# EasyEDA Pro project ProPrj_HEMY 2.0_2025-04-23.epro, board HEMY Redux v2.6.5M
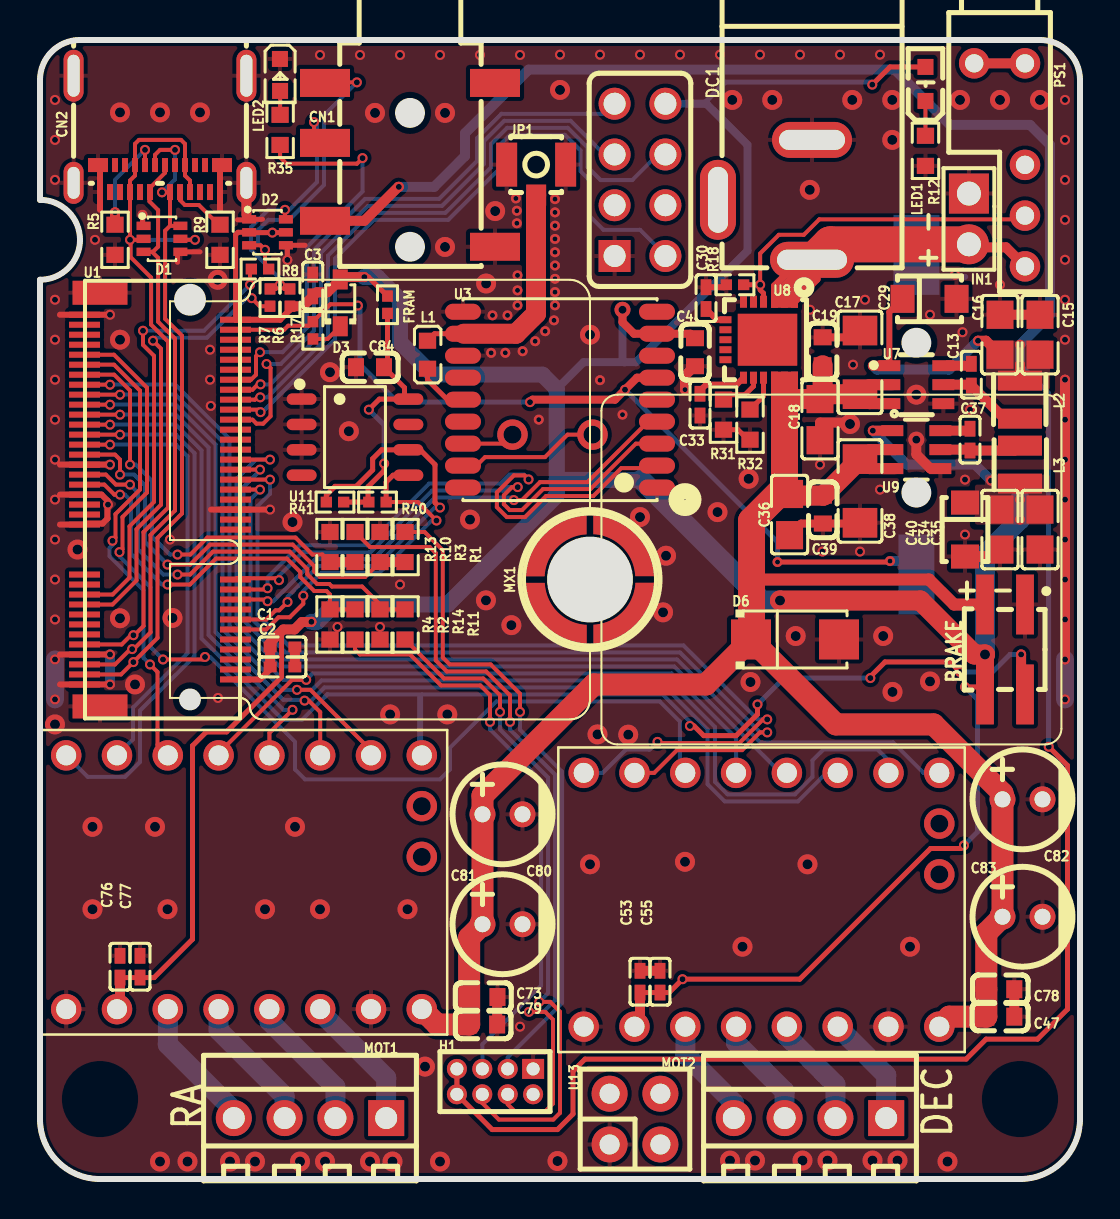
[diagram p8: board, top side]
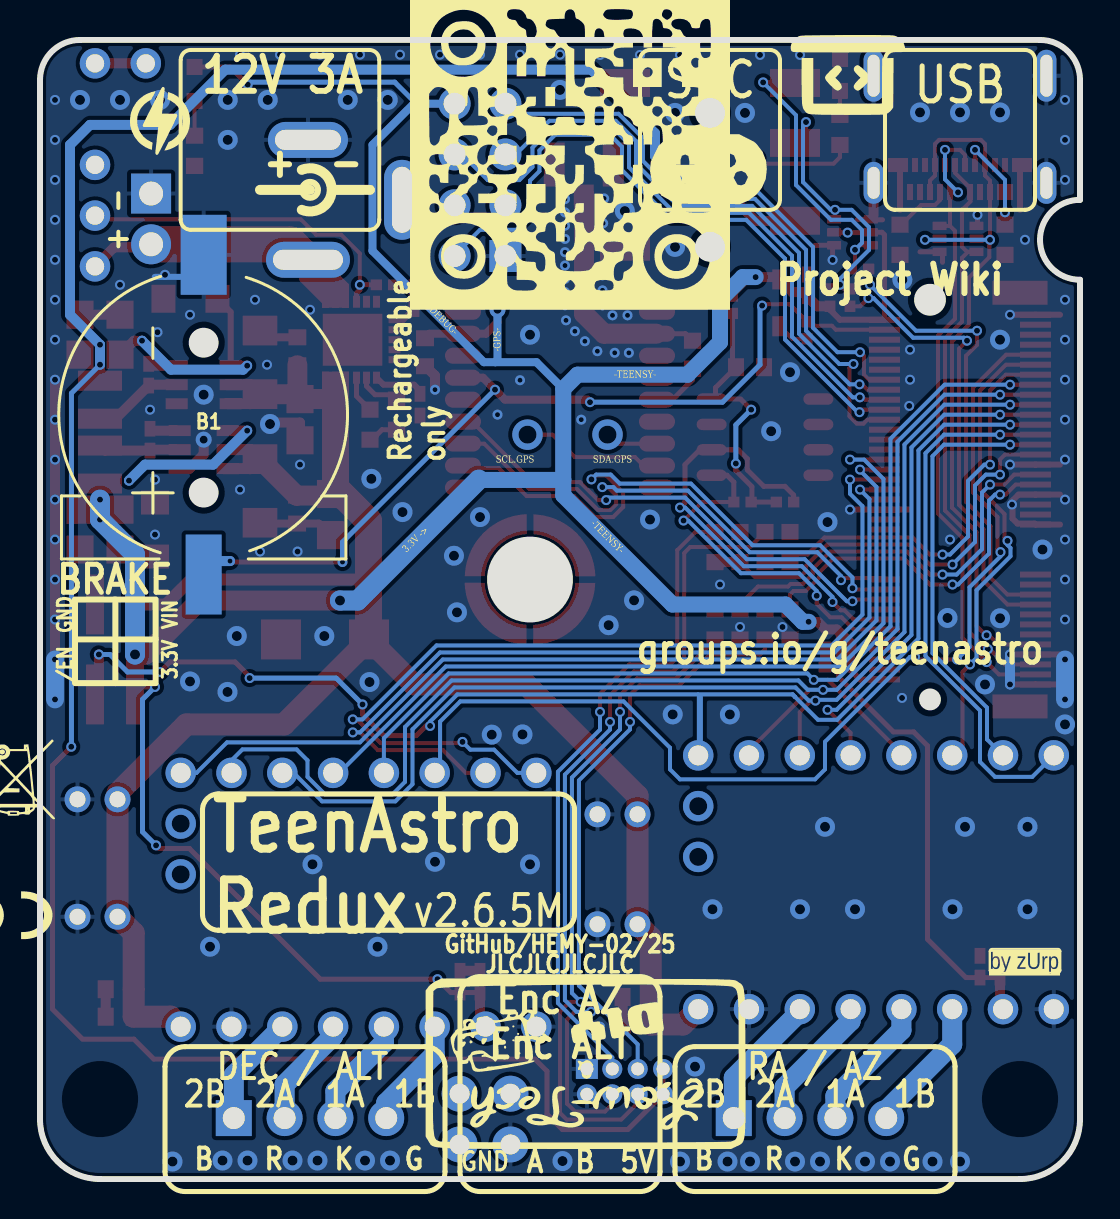
[diagram p9: board, bottom side, seen from below]

Outline 52 x 57 mm; copper layers: Top Layer, Inner_1_GND, Inner_2_GND, Bottom Layer. Coordinates in mm from the lower left corner of the outline.
Outline path: 0,55 arc(0.59,56.41) 2,57 50,57 arc(51.41,56.41) 52,55 52,3 arc(51.12,0.88) 49,0 3,0 arc(0.88,0.88) 0,3 0,45 arc(1.41,45.59) 2,47 arc(1.41,48.41) 0,49 0,55
Stack: Top Layer 0.035mm Outer layer thickness 1oz / Dielectric1 0.48mm 7628 RC49% 8.6mil / Inner_1_GND 0.035mm Inner layer thickness / Dielectric2 0.48mm 1.1mm H/HOZ Copper / Inner_2_GND 0.035mm Inner layer thickness / Dielectric3 0.48mm 7628 RC49% 8.6mil / Bottom Layer 0.035mm Outer layer thickness 1oz

## Design rules (mm)
template: User Custom Config
spacing safeClearance (default): track to track 0.15, other pairs 0 to 0.15
spacing Power: track to track 0.25, other pairs 0 to 0.25
track width trackWidth (default): min 0.15, default 0.25, max 2
track width Power: min 0.25, default 0.5, max 2.5
differential pair differentialPair (default): width min 0.127, default 0.254, max 2.54; gap min 0.152, default 0.152
via viaSize (default): diameter min 0.4, default 0.5, max 2; hole min 0.2, default 0.25, max 1
net VCC uses Power, Vcc_stepper
net GND uses GND, Power
net +3.3V uses Power
net M2_BMB1 uses Power
net M2_BMA1 uses Power
net M1_BMB1 uses Power
net M1_BMA1 uses Power
net M2_BMB2 uses Power
net M2_BMA2 uses Power
net M1_BMB2 uses Power
net M1_BMA2 uses Power
net +5V uses Power
pour e89606 uses GND
pour e56057 uses GND

## Placement (name value [footprint] x y rotation side)
B1  ML1220  [bat-smd_cr1220-2]  43.82 38.25 90 bottom
BRAKE  X4621WVS-2x02I-C40D64  [HDR-SMD_4P-P2.00-V-M-R2-C2-S2.0]  48.25 26.5 180 top
C1  1uF  [C0402#2]  12.12 26.62 180 top
C2  100nF  [C0402#2]  12.12 25.62 180 top
C3  100nF  [C0402]  13.64 44.72 90 top
C4  10uF  [C0603]  32.75 41.37 270 top
C13  100nF  [C0402]  46.57 40.25 270 top
C15  10uF  [C0805]  50 42.25 270 top
C16  10uF  [C0805]  48 42.25 270 top
C17  10uF  [C1206]  41 40.87 270 top
C18  1uF  [C0805#2]  39 38 90 top
C19  100nF  [C0603]  39.13 41.42 270 top
C29  47uF  [CAP-SMD_L3.2-W1.6]  44.48 44.05 0 top
C30  100nF  [C0402]  33.3 44.08 270 top
C33  10nF  [C0402]  33 38.75 270 top
C34  10uF  [C0805]  48 32.5 90 top
C35  10uF  [C0805]  50 32.5 90 top
C36  1uF  [C0805#2]  37.48 33.25 90 top
C37  100nF  [C0402]  46.5 37 270 top
C38  10uF  [C1206]  41 34.43 90 top
C39  100nF  [C0603]  39.14 33.5 90 top
C40  47uF  [CAP-SMD_L3.2-W1.6]  46.25 32.5 270 top
C47  100nF  [C0603]  48.02 8.12 0 top
C53  100nF  [C0402]  30 9.87 90 top
C55  1uF  [C0402]  31 9.87 270 top
C73  100nF  [C0603]  22.17 9.11 0 top
C76  100nF  [C0402]  4 10.62 90 top
C77  1uF  [C0402]  5 10.62 270 top
C78  1uF  [C0603]  48.02 9.5 180 top
C79  1uF  [C0603]  22.16 7.73 180 top
C80  100uF  [CAP-TH_BD5.0-P2.00-D0.8-FD]  23.12 18.25 0 top
C81  100uF  [CAP-TH_BD5.0-P2.00-D0.8-FD]  23.12 12.75 0 top
C82  100uF  [CAP-TH_BD5.0-P2.00-D0.8-FD]  49.12 19 0 top
C83  100uF  [CAP-TH_BD5.0-P2.00-D0.8-FD]  49.12 13.12 0 top
C84  10uF  [C0603]  16.5 40.62 180 top
CN1  PJ-327E-SMT  [AUDIO-SMD_PJ-327E-SMT]  18.5 50.75 180 top
CN2  USB_C  [USB-C-SMD_TYPE-C-USB-18]  6 52.3 180 top
D1  BAV99S,115  [SOT-363_L2.0-W1.3-P0.65-LS2.1-TL]  6.1 47.05 0 top
D2  BAV99S,115  [SOT-363_L2.0-W1.3-P0.65-LS2.1-TL]  11.38 47.37 0 top
D3  1N5819WS  [SOD-323_L1.8-W1.3-LS2.5-RD]  15.01 43.84 90 top
D6  SS34  [SMA_L4.3-W2.6-LS5.2-RD]  37.75 27 0 top
DC1  DC-005-5A-2.0  [DC-IN-TH_DC-005-5A-2.0]  36.25 49 270 top
DEC_TMC  ?  [TMC2130 STEPPER MOTOR DRIVER CARRIER]  36.07 13.97 270 top
FRAM  0Ω  [R0402]  17.38 43.75 90 top
H1  DW127R-22-08-34  [HDR-TH_8P-P1.27-V-F-R2-C4-S1.27]  22.75 4.88 180 top
H2  Debug  [HDR-TH_8P-P2.54-V-F-R2-C4-S2.54]  30 50 270 top
IN1  -  [HDR-TH_2P-P2.54-V-M]  46.45 48.04 270 top
JP1  BWU.FL-IPEX1  [IPEX-SMD_BWIPX-1-001E]  24.81 50 90 top
L1  47nH  [IND-SMD_L1.6-W0.8-1]  19.38 41.25 270 top
L2  10uH  [IND-SMD_L2.5-W2.0_SWPA252012S]  49 39 90 top
L3  10uH  [IND-SMD_L2.5-W2.0_SWPA252012S]  49 35.75 270 top
LED1  KT-0603W  [LED0603-R-RD_WHITE]  44.27 54.8 90 top
LED2  KT-0603R  [LED0603-RD]  12 55.25 270 top
MOT1  DB125-2.54-4P-GN-S  [CONN-TH_DB125-2.54-4P-GN]  13.5 3.05 180 top
MOT2  DB125-2.54-4P-GN-S  [CONN-TH_DB125-2.54-4P-GN]  38.5 3.05 180 top
MX1  Plot M.2  [SMD_BD5.6-D4.1]  27.5 30 0 top
PS1  -  [Power_switch]  49.25 50.75 180 top
R1  1.5kΩ  [R0603]  18.25 31.62 270 top
R2  1.5kΩ  [R0603]  15.75 27.75 90 top
R3  3kΩ  [R0603]  17 31.62 90 top
R4  3kΩ  [R0603]  14.5 27.75 270 top
R5  5.1kΩ  [R0603]  3.75 47 90 top
R6  10kΩ  [R0402]  12.5 44.11 90 top
R7  22Ω  [R0402]  11.5 44.11 90 top
R8  22Ω  [R0402]  11 45.54 0 top
R9  5.1kΩ  [R0603]  9 47 270 top
R10  1.5kΩ  [R0603]  15.75 31.62 270 top
R11  1.5kΩ  [R0603]  18.25 27.75 90 top
R12  150Ω  [R0603]  44.27 51.45 270 top
R13  3kΩ  [R0603]  14.5 31.62 90 top
R14  3kΩ  [R0603]  17 27.75 270 top
R17  1kΩ  [R0402]  13.65 42.47 90 top
R18  10kΩ  [R0402]  34.75 44.75 0 top
R31  33kΩ  [R0603]  34.17 38.25 90 top
R32  240kΩ  [R0603]  35.5 37.75 90 top
R35  150Ω  [R0603]  12.01 52.5 90 top
R40  10kΩ  [R0402]  16.88 33.87 0 top
R41  10kΩ  [R0402]  14.75 33.87 0 top
RA_TMC  ?  [TMC2130 STEPPER MOTOR DRIVER CARRIER]  10.2 14.85 270 top
U1  MICROMOD-Teensy4  [M.2-CONNECTOR-E]  7.5 34 270 top
U3  ATGM336H-6N-74  [COMM-SMD_18P-L10.1-W9.7-P1.1-TL_L76-LB]  26 39 180 top
U7  AP63205WU-7  [TSOT-23-6_L2.9-W1.6-P0.95-LS2.8-BL]  43.82 39.75 270 top
U8  DPS1135FIA-13  [QFN-17_L4.0-W4.0-P0.50-TL-EP]  36 42 270 top
U9  AP63203WU-7  [TSOT-26_L2.9-W1.6-P0.95-LS2.8-BL]  43.82 36.5 270 top
U11  MB85RC64TAPNF-G-BDERE1  [SOP-8_L5.0-W4.0-P1.27-LS6.0-BL]  15.75 37.12 270 top
U13  2.54-2*2  [HDR-TH_4P-P2.54-V-F-R2-C2-S2.54]  29.75 3 0 top

## Footprints (pads in the part's own frame, mm; a bottom-side part is the same pattern mirrored in y, then rotated)
AUDIO-SMD_PJ-327E-SMT
  rect 2.5x1.4 smd: 1(-4.25,4.1) 2(4.25,-4.1) 3(4.25,-1.1) 4(4.25,2.8) 5(-4.25,-4.1)
bat-smd_cr1220-2
  rect 4x1.8 smd: 1(-8,0)
  rect 4x2.3 smd: 2(8,0)
C0402
  rect 0.79x0.54 smd: 1(-0.545,0) 2(0.545,0)
C0402#2
  rect 0.645x0.54 smd: 1(-0.618,0) 2(0.618,0)
C0603
  rect 0.8x0.9 smd: 1(-0.7,0) 2(0.7,0)
C0805
  rect 1.41x1.35 smd: 1(-1,0) 2(1,0)
C0805#2
  rect 1.41x1.35 smd: 1(-1.03,0) 2(1.03,0)
C1206
  rect 1.485x1.728 smd: 1(-1.593,0) 2(1.593,0)
CAP-SMD_L3.2-W1.6
  rect 1.2x1.4 smd: 1(-1.35,0) 2(1.35,0)
CAP-TH_BD5.0-P2.00-D0.8-FD
  round 1.3 hole 0.8: 1(-1,0) 2(1,0)
COMM-SMD_18P-L10.1-W9.7-P1.1-TL_L76-LB
  custom 1.8x0.8 smd: 1(-4.85,4.4) 2(-4.85,3.3) 3(-4.85,2.2) 4(-4.85,1.1) 5(-4.85,0) 6(-4.85,-1.1) 7(-4.85,-2.2) 8(-4.85,-3.3) 9(-4.85,-4.4) 10(4.85,-4.4) 11(4.85,-3.3) 12(4.85,-2.2) 13(4.85,-1.1) 14(4.85,0) 15(4.85,1.1) 16(4.85,2.2) 17(4.85,3.3) 18(4.85,4.4)
CONN-TH_DB125-2.54-4P-GN
  rect 1.8x1.8 hole 1.1: 1(-3.81,0)
  round 1.8 hole 1.1: 2(-1.27,0) 3(1.27,0) 4(3.81,0)
DC-IN-TH_DC-005-5A-2.0
  oval 1.8x4.2 hole 1x3.5: 1(3,2.352)
  oval 1.8x4 hole 1x3.3: 2(-3,2.352)
  oval 4x1.8 hole 3.3x1: 3(-0.001,-2.352)
HDR-SMD_4P-P2.00-V-M-R2-C2-S2.0
  rect 0.89x3 smd: 1(-1,-2.25) 2(-1,2.25) 3(1,-2.25) 4(1,2.25)
HDR-TH_2P-P2.54-V-M
  rect 2x2 hole 1.2: 1(-1.27,0)
  round 2 hole 1.2: 2(1.27,0)
HDR-TH_4P-P2.54-V-F-R2-C2-S2.54
  round 1.8 hole 1: 1(-1.27,-1.27) 2(-1.27,1.27) 3(1.27,-1.27) 4(1.27,1.27)
HDR-TH_8P-P1.27-V-F-R2-C4-S1.27
  rect 1.1x1 hole 0.65: 1(-1.905,-0.635)
  round 1 hole 0.65: 2(-1.905,0.635) 3(-0.635,-0.635) 4(-0.635,0.635) 5(0.635,-0.635) 6(0.635,0.635) 7(1.905,-0.635) 8(1.905,0.635)
HDR-TH_8P-P2.54-V-F-R2-C4-S2.54
  round 1.6 hole 1.1: 1(-3.81,-1.27) 2(-3.81,1.27) 3(-1.27,-1.27) 4(-1.27,1.27) 5(1.27,-1.27) 6(1.27,1.27) 8(3.81,1.27)
  rect 1.6x1.6 hole 1.1: 7(3.81,-1.27)
IND-SMD_L1.6-W0.8-1
  rect 0.8x0.864 smd: 1(0.7,0) 2(-0.7,0)
IND-SMD_L2.5-W2.0_SWPA252012S
  rect 1x2.2 smd: 1(-0.951,0) 2(0.951,0)
IPEX-SMD_BWIPX-1-001E
  rect 1.05x1 smd: 1(-0.762,0)
  rect 2.2x1.05 smd: 2(0.762,-1.475) 3(0.762,1.475)
LED0603-R-RD_WHITE
  rect 0.8x0.8 smd: 1(0.851,0) 2(-0.851,0)
LED0603-RD
  rect 0.8x0.8 smd: 1(-0.799,-0.004) 2(0.799,0.004)
M.2-CONNECTOR-E
  custom 0.3x1.55 smd: 1(9.25,-5.275) 2(9,2.275) 3(8.75,-5.275) 4(8.5,2.275) 5(8.25,-5.275) 6(8,2.275) 7(7.75,-5.275) 8(7.5,2.275) 9(7.25,-5.275) 10(7,2.275) 11(6.75,-5.275) 12(6.5,2.275) 13(6.25,-5.275) 14(6,2.275) 15(5.75,-5.275) 16(5.5,2.275) 17(5.25,-5.275) 18(5,2.275) 19(4.75,-5.275) 20(4.5,2.275) 21(4.25,-5.275) 22(4,2.275) 23(3.75,-5.275) 32(1.5,2.275) 33(1.25,-5.275) 34(1,2.275) 35(0.75,-5.275) 36(0.5,2.275) 37(0.25,-5.275) 38(0,2.275) 39(-0.25,-5.275) 40(-0.5,2.275) 41(-0.75,-5.275) 42(-1,2.275) 43(-1.25,-5.275) 44(-1.5,2.275) 45(-1.75,-5.275) 46(-2,2.275) 47(-2.25,-5.275) 48(-2.5,2.275) 49(-2.75,-5.275) 50(-3,2.275) 51(-3.25,-5.275) 52(-3.5,2.275) 53(-3.75,-5.275) 54(-4,2.275) 55(-4.25,-5.275) 56(-4.5,2.275) 57(-4.75,-5.275) 58(-5,2.275) 59(-5.25,-5.275) 60(-5.5,2.275) 61(-5.75,-5.275) 62(-6,2.275) 63(-6.25,-5.275) 64(-6.5,2.275) 65(-6.75,-5.275) 66(-7,2.275) 67(-7.25,-5.275) 68(-7.5,2.275) 69(-7.75,-5.275) 70(-8,2.275) 71(-8.25,-5.275) 72(-8.5,2.275) 73(-8.75,-5.275) 74(-9,2.275) 75(-9.25,-5.275)
  custom 1.2x2.75 smd: 1(10.35,-4.5) 75(-10.35,-4.5)
Power_switch
  round 1.524 hole 0.914: 1(0,-5.08) 2(2.54,-5.08) 4(0,5.08) 5(0,2.54) 6(0,0)
QFN-17_L4.0-W4.0-P0.50-TL-EP
  rect 0.6x0.35 smd: 1(-1.9,1.726) 2(-1.9,1.226) 3(-1.9,0.726) 4(-1.9,0.175) 5(-1.9,-0.326) 6(-1.9,-0.826) 12(1.9,-0.826) 13(1.9,-0.326) 14(1.9,0.175) 15(1.9,0.726) 16(1.9,1.226) 17(1.9,1.726)
  rect 0.6x1.35 smd: 1(-1.9,1.225) 17(1.9,1.224)
  rect 0.35x0.6 smd: 7(-1,-1.726) 8(-0.5,-1.726) 9(0,-1.726) 10(0.5,-1.726) 11(1,-1.726)
  rect 2.6x2.975 smd: 18(0,0.374)
R0402
  rect 0.566x0.54 smd: 1(-0.433,0) 2(0.433,0)
R0603
  rect 0.806x0.864 smd: 1(-0.753,0) 2(0.753,0)
SMA_L4.3-W2.6-LS5.2-RD
  rect 2x2 smd: 1(-2.2,0) 2(2.2,0)
SMD_BD5.6-D4.1
  custom 3.1x3.1 smd: 1(-2.17,1.71) 1(-1.71,-2.17) 1(1.71,2.17) 1(2.17,-1.71)
SOD-323_L1.8-W1.3-LS2.5-RD
  rect 1x0.75 smd: 1(-1.173,0) 2(1.173,0)
SOP-8_L5.0-W4.0-P1.27-LS6.0-BL
  oval 0.574x1.5 smd: 1(-1.905,-2.668) 2(-0.635,-2.668) 3(0.635,-2.668) 4(1.905,-2.668) 5(1.905,2.668) 6(0.635,2.668) 7(-0.635,2.668) 8(-1.905,2.668)
SOT-363_L2.0-W1.3-P0.65-LS2.1-TL
  rect 0.7x0.42 smd: 1(-0.92,0.65) 2(-0.92,0) 3(-0.92,-0.65) 4(0.92,-0.65) 5(0.92,0) 6(0.92,0.65)
TMC2130 STEPPER MOTOR DRIVER CARRIER
  round 1.524 hole 1x0.9: 1(-6.35,8.89) 2(-6.35,6.35) 3(-6.35,3.81) 4(-6.35,1.27) 5(-6.35,-1.27) 6(-6.35,-3.81) 7(-6.35,-6.35) 8(-6.35,-8.89) 9(6.35,-8.89) 10(6.35,-6.35) 11(6.35,-3.81) 12(6.35,-1.27) 13(6.35,1.27) 14(6.35,3.81) 15(6.35,6.35) 16(6.35,8.89)
TSOT-23-6_L2.9-W1.6-P0.95-LS2.8-BL
  rect 0.55x1.1 smd: 1(-0.95,-1.35) 2(0,-1.35) 3(0.95,-1.35) 4(0.95,1.35) 5(0,1.35) 6(-0.95,1.35)
TSOT-26_L2.9-W1.6-P0.95-LS2.8-BL
  rect 0.55x1.1 smd: 1(-0.95,-1.2) 2(0,-1.2) 3(0.95,-1.2) 4(0.95,1.2) 5(0,1.2) 6(-0.95,1.2)
USB-C-SMD_TYPE-C-USB-18
  oval 1x2.1 hole 0.6x1.6: 0(-4.32,2.45) 0(4.32,2.45)
  oval 1x2.6 hole 0.6x2.1: 0(-4.32,-2.91) 0(4.32,-2.91)
  rect 0.3x0.8 smd: A1(-3,2.91) A2(-2.5,2.91) A3(-2,2.91) A4(-1.5,2.91) A5(-1,2.91) A6(-0.5,2.91) A7(0.5,2.91) A8(1,2.91) A9(1.5,2.91) A10(2,2.91) A11(2.5,2.91) A12(3,2.91)
  rect 1x0.7 smd: B1(3.1,1.56)
  rect 0.3x0.7 smd: B2(2.25,1.56) B3(1.75,1.56) B4(1.25,1.56) B5(0.75,1.56) B6(0.25,1.56) B7(-0.25,1.56) B8(-0.75,1.56) B9(-1.25,1.56) B10(-1.75,1.56) B11(-2.25,1.56)
  custom 1x0.7 smd: B12(-3.1,1.56)

## Nets
As in the schematic.

Pads without a net: CN1 5; CN2 A2 A3 A8 A10 A11 B2 B3 B8 B10 B11; DC1 3; H2 5 6; PS1 6; U1 4 6 8 11 13 15 16 21 23 34 35 37 38 48 50 52 64 66 68 69 70 71 73; U3 5 7 9 13 15 18; U8 5 8 9 10 11 18; U11 4 7

## Via types
v1: diameter 1.524, hole 0.9, Top Layer to Bottom Layer, 6 vias
v2: diameter 1, hole 0.5, Top Layer to Bottom Layer, 81 vias
v3: diameter 0.5, hole 0.25, Top Layer to Bottom Layer, 29 vias
v4: diameter 0.5, hole 0.3, Top Layer to Bottom Layer, 176 vias
v5: diameter 0.8, hole 0.4, Top Layer to Bottom Layer, 2 vias

## Routing (per net, layer and track width the routed paths; a pad name or vN(x,y) marks a point on that pad's centre or on a via; arc(x,y) is an arc through that point)
+3.3V: length 194.4
  Top Layer w0.25: 9.78,43 9.78,47.26 9.9,47.37 D2.2 10.47,47.36 v4(11.62,47.36) 12.28,47.36 D2.5 ; v4(41.61,54.76) 42.5,55.65 LED1.1 ; 12.08,27.25 12.08,25.12 9.33,22.37 8.32,22.37 7.62,21.68 7.62,12 5.7,10.08 C77.2 C76.1 ; C53.1 C55.2 31.45,9.33 v4(32.12,10) 37.99,10 44.53,16.54 46.04,16.54 v4(46.2,16.7) ; v4(46.25,24.62) 46.88,24.62 BRAKE.4 ; FRAM.2 16.42,45.13 v4(16.22,45.13)
  Top Layer w0.3: R6.1 12.5,43.5 12,43 U1.74 ; U1.2 11,25 11.51,25.51 C2.2
  Top Layer w0.4: C4.1 32.53,42.3 U3.8 29.7,42.3 29.12,42.87 v5(29.12,43.5)
  Top Layer w0.5: R6.1 13.14,43.67 C3.1 13.84,44.37 14.37,44.37 D3.2 15.13,45.13 v4(16.22,45.13) ; C53.1 30,7.9 DEC_TMC.10 ; C2.2 C1.2 11.51,26.84 12.16,27.5 12.72,27.5 13.1,27.87 13.56,27.87 v4(13.57,27.88) ; RA_TMC.10 4,8.65 C76.1 ; 42.8,37.45 v4(41.64,37.45)
  Top Layer w0.9: v2(47.25,26.25) 47.25,24.75
  Top Layer w1: v2(47.25,26.25) 46.72,26.25 44.02,28.95 v2(37,28.95)
  Bottom Layer w0.25: 33.19,53.81 34.27,54.89 41.5,54.89 41.61,54.78 v4(41.61,54.76) ; v4(46.25,24.62) 46.88,24 46.88,17.37 v4(46.2,16.7)
  Bottom Layer w0.4: 29.24,40.87 29.12,40.99 v5(29.12,43.5) ; 29.24,40.87 27.17,40.87 25.84,39.54 ; 29.24,40.87 29.8,40.87 35.38,46.45 35.38,51.75 33.31,53.81 31.27,53.81
  Bottom Layer w0.5: v4(47.55,34.95) 46.75,35.75 43.34,35.75 v4(41.64,37.45)
  Bottom Layer w0.8: 25.84,34.98 25.84,34.21 20.38,28.75 14.73,28.75 13.86,27.88 v4(13.57,27.88) ; 25.84,34.98 30.05,34.98 30.06,35 ; 25.84,34.98 25.84,39.54 25.12,40.25 19.62,40.25 18,41.87 18,44 16.87,45.13 v4(16.22,45.13)
  Bottom Layer w1: v4(49,34) v4(49,33) 47.25,31.25 v2(47.25,26.25) ; v2(37,28.95) 36.11,28.95 30.06,35
+5V: length 135.2
  Top Layer w0.25: H1.7 H1.8 22.61,2.47 25.87,2.47 26.65,3.25 26.65,5.4 27.25,6 46.31,6 47.31,7 49.88,7 51.38,8.5 51.38,20.69 v4(50.44,21.63)
  Top Layer w0.3: U7.1 42.47,43.39 C29.1
  Top Layer w0.5: v4(17.94,49.65) 17.91,49.65 16.22,47.95 CN1.4 ; C16.2 47.3,41.95 v4(46.9,41.95) ; v4(49,40.75) L2.2 ; 42.4,40.7 41.65,40.7
  Bottom Layer w0.25: v4(49,40.75) 50.43,39.32 50.43,21.64 v4(50.44,21.63)
  Bottom Layer w0.5: v4(49,40.75) v4(49,41.75) 50.5,43.25 50.5,51.75 49.5,52.75 45.5,52.75 42.74,55.51 24.43,55.51 21.25,52.33 21.25,51.19 19.71,49.65 v4(17.94,49.65) ; 41.65,40.7 41.85,40.5 45.45,40.5 v4(46.9,41.95)
  vias: v4(41.64,40.7)
GND: length 74.7
  Top Layer w0.25: 8,46.4 D1.4 6.88,46.25 6.88,45.87 ; 13.25,46.72 12.29,46.72 12.37,46.65 v4(12.37,45.99) ; 11.12,48.02 D2.1 10.43,48 9.88,48 ; 34.17,37.5 34.9,37.5 35.4,37 35.5,37 ; v4(5.12,48.25) 5.12,47.75 5.18,47.7
  Top Layer w0.3: 9,48.5 CN2.A1 9,50.64 CN2.B12 ; CN2.B1 3,50.64 CN2.A12 3,48.5 ; v4(3.5,43.25) U1.75 1,43.25 ; R18.1 34.19,44.63 C30.1 ; 8.55,33.5 U1.36 v4(11.5,33.5) ; 1,35.75 U1.45 v4(3.5,35.75) ; 1,34.25 U1.39 3.07,34.25 3.4,33.92 v4(3.4,33.75) 3.38,33.75 3.38,33.05 3.12,32.8 2.27,32.8 U1.33 1,32.75 ; 1,24.75 U1.1 v4(3.5,24.75) ; 1,26.25 U1.7 v4(3.5,26.25)
  Top Layer w0.4: C36.1 38.06,32.8 C39.1 40.89,32.8 41,32.91 ; C19.1 40.78,42.12 41,42.34
  Top Layer w0.5: v3(32.25,39.5) 32.25,40.21 32.72,40.67 C4.2 ; C79.1 22.86,9.09 C73.2 ; CN2.0 10.32,48.25 ; C53.2 C55.1 ; C78.1 C47.2 ; v4(51.25,40) v4(51.25,38) v4(51.25,36) v4(51.25,34) v4(51.25,32) v4(51.25,30) v4(51.25,28) v4(51.25,26) ; C18.1 39,37.85 40.43,37.85 v2(40.5,37.78) ; C16.1 C15.1 ; 45.2,35.55 44.53,35.55 43.82,36.26 v5(43.82,37) ; C2.1 C1.1
  Top Layer w0.55: C34.1 47.65,31.15 C40.2
  Bottom Layer w0.3: 44.5,45.15 46.26,45.15
  Bottom Layer w0.5: v4(3.5,24.75) v4(3.5,26.25)
  Bottom Layer w0.894: v4(51.25,24) v4(51.25,26) ; v4(0.75,26) v4(0.75,24)
  vias: v2(0.75,22.75) v2(1.88,31.5) v2(2.62,17.62) v2(2.62,13.5) v2(4,53.37) v2(4,42) v2(4,28.06) v2(4.75,24.75) v2(5.75,17.62) v2(6,53.37) v2(6,0.88) v2(6.38,13.5) v2(6.62,28.08) v2(7.38,0.88) v2(8,53.37) v2(8.88,45) v2(9.5,0.88) v2(10.75,0.88) v2(11.25,13.5) v2(12.62,32.87) v2(12.75,17.62) v2(13,0.88) v2(14,13.5) v2(14.25,0.88) v2(14.5,40.37) v2(15.44,37.42) v2(16.5,0.88) v2(16.75,53.35) v2(17.51,23.25) v2(17.62,0.88) v2(18.38,13.5) v2(19.25,5.62) v2(20,0.88) v2(20.25,53.35) v2(20.25,46.64) v2(20.37,23.25) v2(21.5,33) v2(22.31,44.81) v2(22.3,28.96) v2(22.76,48.44) v2(23.57,27.72) v2(25.88,0.9) v2(26,54.5) v2(27.5,42.25) v2(27.5,15.75) v2(27.88,22.25) v2(29.41,22.24) v2(30,33.12) v2(31.15,28.36) v2(31.3,31.19) v2(32.25,15.87) v2(33.88,33.37) v2(34.5,0.92) v2(34.61,54) v2(35.12,11.62) v2(35.43,35.04) v2(35.53,24.87) v2(35.75,0.92) v2(36.61,54) v2(37.78,27.17) v2(38.12,0.92) v2(38.38,15.75) v2(38.49,49.5) v2(39.38,0.92) v2(40.61,54) v2(41.62,0.92) v2(42.16,27.17) v2(42.61,54) v2(42.61,52) v2(42.62,24.37) v2(42.88,0.92) v2(43.5,11.62) v2(43.82,39.25) v2(44.5,24.9) v2(45.38,0.88) v2(46,54) v2(48,54) v2(50,54) v3(22.56,41.34) v3(22.62,43.22) v3(23.26,41.35) v3(23.38,43.22) v3(23.79,49.07) v3(23.84,48.45) v3(23.84,47.83) v3(23.88,45.22) v3(23.88,44.47) v3(23.88,43.72) v3(24.13,41.42) v3(24.76,41.92) v3(24.94,38) v3(25.26,42.42) v3(25.75,49.04) v3(25.75,48.37) v3(25.75,47.71) v3(25.75,47.04) v3(25.75,46.38) v3(25.75,45.71) v3(25.75,45.05) v3(25.75,44.38) v3(25.75,43.72) v3(25.7,42.97) v3(28,39.97) v3(29.12,38.25) v4(0.75,54) v4(0.75,52) v4(0.75,50) v4(0.75,44) v4(0.75,42) v4(0.75,40) v4(0.75,38) v4(0.75,36) v4(0.75,34) v4(0.75,32) v4(0.75,30) v4(0.75,28) v4(2.75,47) v4(6.5,32) v4(8.5,41.5) v4(8.5,40) v4(8.54,38.69) v4(8.9,24.07) v4(14,56.25) v4(14.88,27.62) v4(16,56.25) v4(17,27.62) v4(18,56.25) v4(18,29.75) v4(20,56.25) v4(22,56.25) v4(24,56.25) v4(24,7.62) v4(26,56.26) v4(28,56.26) v4(30,56.26) v4(32,56.26) v4(34,56.26) v4(36,56.26) v4(38,56.26) v4(38.5,43.5) v4(39,35.75) v4(39.12,31.4) v4(40,56.26) v4(40.65,40.75) v4(41,31.4) v4(41.25,44) v4(42,56.26) v4(42,34.5) v4(44.5,43.25) v4(45.75,45.25) v4(46.12,42.37) v4(46.25,35) v4(46.25,32.25) v4(46.5,38.5) v4(48,44.75) v4(51.25,54) v4(51.25,52) v4(51.25,50) v4(51.25,48) v4(51.25,46) v4(51.25,44) v4(51.25,42)
VBAT: length 44.8
  Top Layer w0.2: U1.72 12.21,42.5 12.41,42.7 13.44,42.7 R17.2 14.52,43.77 15.83,43.77 v4(15.89,43.71)
  Top Layer w0.25: v3(36.88,30.87) 42.45,30.87 v3(42.5,30.92)
  Top Layer w0.4: 30.81,40.1 29.85,40.1 v4(29.25,39.5) 28.75,39 24.62,39 v4(24.5,38.87)
  Bottom Layer w0.25: v4(15.89,43.71) 16,43.6 16,40.75 17.88,38.87 v4(24.5,38.87) ; v4(29.25,39.5) 36.88,31.87 v3(36.88,30.87)
  Bottom Layer w0.5: B1.1 43.14,30.92 v3(42.5,30.92)
VCC: length 108.1
  Top Layer w0.35: 37.47,39 37.47,40.1 ; U8.15 36.72,39 ; 36.97,40.1 36.97,39 ; U8.16 37.22,39.25 ; 37.72,39.03 U8.17
  Top Layer w0.55: 42.65,38.8 41.47,38.8 C17.2 41.47,39.75 42.65,39.75 ; 42.8,36.5 41.47,36.5 C38.2 41.47,35.55 42.8,35.55
  Top Layer w0.6: 35.58,29.87 35.7,30 44.45,30 45.7,28.75 BRAKE.3 47.25,29.25
  Top Layer w1: C18.2 37.72,39.03 ; C17.2 39.38,39.27 39.25,39.41 ; C36.2 37.56,34.2 C39.2 39.17,34.2 C38.2 ; 39.13,39.55 39.13,40.72
  Top Layer w1.1: RA_TMC.16 19.86,7.73 C79.2 21.46,12.08 C81.1 C80.1 22.12,19.18 27.69,24.75 33.3,24.75 D6.1 39.8,22.75 44.68,22.75 48.12,19.3 C82.1 C83.1 47.32,12.32 C78.2 C47.1 45.47,8.12 DEC_TMC.16
  Top Layer w1.35: 37.22,39.25 37.22,34.59 35.58,32.94 35.58,27.03 D6.1
(no net):
  vias: v1(19.09,18.66) v1(19.09,16.12) v1(44.97,17.78) v1(44.97,15.24)
D+: length 75.8
  Top Layer w0.2: 5.75,50.74 5.75,51.25 6,51.5 v4(6.75,51.5) ; 6.5,47.7 D1.6 ; 6.5,47.7 6.26,47.45 6.26,43.04 7.1,42.2 7.1,33.31 5.88,32.08 5.88,27.07 v4(4.67,25.87) 4.05,25.25 U1.3 ; 6.5,47.7 CN2.A6 6.48,49.37 v4(6.1,49.37)
  Inner_1_GND w0.2: v4(4.67,25.87) 4.24,25.87 4,25.62 4,22.87 5.12,21.75 5.12,19.75 10.12,14.75 10.12,8.12 12.28,5.97 17.39,5.97 19.22,4.14 19.22,2.77 19.64,2.35 25.35,2.35 27.27,4.27 U13.2
  Bottom Layer w0.2: v4(6.1,49.37) 6.75,50.03 v4(6.75,51.5)
D-: length 72.6
  Top Layer w0.2: 5.6,46.4 5.65,46.4 5.91,46.65 5.91,48.49 5.47,48.92 5.47,49.36 CN2.A7 5.5,49.6 6.25,50.35 CN2.B7 ; 5.6,46.4 5.91,46.1 5.91,42.9 6.75,42.05 6.75,33.45 5.53,32.23 5.53,27.36 4.69,26.52 v4(4.61,26.52) 4.52,26.52 3.75,25.75 U1.5 ; 5.6,46.4 5.18,46.4
  Inner_1_GND w0.2: U13.4 28.79,6.5 14.25,6.5 12.75,8 12.75,14.87 7.62,20 7.62,22 6.12,23.5 6.12,25.27 6.65,25.79 6.65,26.21 6.36,26.5 4.62,26.5 v4(4.61,26.52)
LED: length 19.8
  Top Layer w0.2: U1.62 10.55,40 10.8,40.25 10.8,41.17 v4(11,41.37) ; v4(16.13,51.09) 15.85,50.81 12.32,50.81 12.01,51.13 R35.1
  Bottom Layer w0.2: v4(16.13,51.09) 16.13,49.42 13.35,46.64 13.35,42.6 12.12,41.37 v4(11,41.37)
M1_BMA1: length 6.8
  Bottom Layer w1: MOT1.3 12.23,4.14 8.93,7.44 RA_TMC.12
M1_BMA2: length 6.8
  Bottom Layer w1: RA_TMC.11 6.39,6.73 9.69,3.44 MOT1.4
M1_BMB1: length 6.8
  Bottom Layer w1: 14.77,3.05 14.77,4.6 11.47,7.9 RA_TMC.13
M1_BMB2: length 6.8
  Bottom Layer w1: MOT1.1 17.31,5.06 14.01,8.36 RA_TMC.14
M1_CS: length 24.8
  Top Layer w0.2: U1.55 v4(4,38.25) ; RA_TMC.4 11.47,22.33 v4(12.62,23.48)
  Bottom Layer w0.2: v4(4,38.25) 6.78,38.25 8.43,36.61 8.43,27.22 12.17,23.48 v4(12.62,23.48)
M1_DIR: length 26.9
  Top Layer w0.2: U1.51 v4(4,37.25)
  Bottom Layer w0.2: RA_TMC.8 2.38,20.12 4.25,20.12 5,20.87 5,23.44 7.73,26.17 7.73,36.32 6.8,37.25 v4(4,37.25)
M1_ENA: length 67.8
  Top Layer w0.2: v4(3.5,37.75) U1.53
  Top Layer w0.25: v4(41.52,25.07) 41.52,25.14 42.25,25.87 45.5,25.87 v4(46,25.37) ; v4(35.88,23.75) 35.88,23.26 34.81,22.19 33.19,22.19 32.7,22.67 v4(32.5,22.67)
  Top Layer w0.5: v4(49.06,26.25) 49.06,24.44 BRAKE.2
  Bottom Layer w0.2: 19.09,24.25 19.01,24.17 ; 19.09,24.25 31.13,24.25 32.5,22.89 v4(32.5,22.67) ; 19.09,24.25 14.38,24.25 ; 14.25,24.13 14.25,24.13 13.1,22.98 12.14,22.98 8.08,27.05 8.08,36.46 6.79,37.75 v4(3.5,37.75) ; 14.25,24.13 14.25,24.13 14.37,24.25 14.38,24.25 ; 14.25,24.13 14.38,24.25 ; 19.01,21.28 RA_TMC.1
  Bottom Layer w0.25: v4(49.06,26.25) 48.5,26.25 47.62,25.37 v4(46,25.37) ; v4(35.88,23.75) 37.19,25.07 v4(41.52,25.07)
  Bottom Layer w0.3: 19.01,24.17 19.01,21.28
M1_ENCA: length 21.9
  Top Layer w0.2: v4(6.38,30.75) 7.51,30.75 8.51,31.75 12.63,31.75 13.72,30.66 13.72,30.41 14,30.12 16.25,30.12 R3.1 ; U1.47 3.75,36.25 4,36 v4(4,35.25)
  Top Layer w0.5: R3.1 R1.2
  Bottom Layer w0.2: v4(6.38,30.75) 5.25,31.87 5.25,34.71 4.71,35.25 v4(4,35.25)
M1_ENCA_IN: length 33
  Top Layer w0.2: R1.1 19.23,32.38 20.14,31.47 20.14,26.1 20.49,25.75 22.53,25.75 24,24.28 v4(24,23.37)
  Bottom Layer w0.2: H1.3 23.38,6.09 26.1,8.8 26.1,20.38 24,22.48 v4(24,23.37)
M1_ENCB: length 19.3
  Top Layer w0.2: R2.2 R4.1 14.5,29.25 14.32,29.42 13.71,29.42 13.01,30.12 13.01,30.37 12.34,31.05 8.8,31.05 7.5,29.75 v4(6.38,29.75) ; v4(4,34.25) 3.72,34.25 3.22,34.75 U1.41
  Bottom Layer w0.2: v4(6.38,29.75) 6.09,29.75 4.55,31.29 4.55,33.95 4.25,34.25 v4(4,34.25)
M1_ENCB_IN: length 29.2
  Top Layer w0.2: v4(22.5,22.87) 22.5,24.22 22.02,24.7 20.05,24.7 18.5,26.25 16,26.25 15.75,26.5 15.75,27
  Bottom Layer w0.2: H1.5 22.11,6.74 25.05,9.68 25.05,19.95 22.5,22.5 v4(22.5,22.87)
M1_M4: length 23.4
  Top Layer w0.2: U1.65 3.7,40.75 5,39.45 5,34.5 3.78,33.27 3.78,32.09 v4(3.62,31.94) ; v4(5.5,25.75) 5.88,25.37 5.88,21.71 RA_TMC.6
  Bottom Layer w0.2: v4(3.62,31.94) 3.62,31.73 3.47,31.58 3.47,31.16 5.17,29.46 5.17,26.07 v4(5.5,25.75)
M1_STEP: length 21.8
  Top Layer w0.2: U1.49 v4(3.5,36.75)
  Bottom Layer w0.2: v4(3.5,36.75) 6.8,36.75 7.38,36.17 7.38,26.32 4.65,23.59 4.65,22 RA_TMC.7
M2_BMA1: length 5.6
  Bottom Layer w1: DEC_TMC.12 34.81,6.82 37.23,4.39 MOT2.3
M2_BMA2: length 5.6
  Bottom Layer w1: MOT2.4 34.69,3.81 32.26,6.23 DEC_TMC.11
M2_BMB1: length 5.6
  Bottom Layer w1: 39.77,3.05 39.77,4.73 37.34,7.15 DEC_TMC.13
M2_BMB2: length 5.6
  Bottom Layer w1: DEC_TMC.14 42.31,5.2 MOT2.1
M2_CS: length 41.6
  Top Layer w0.2: v4(11.5,36) U1.46
  Bottom Layer w0.2: DEC_TMC.4 37.04,20.32 31.71,25.65 11.98,25.65 9.83,27.81 9.83,35.03 10.79,36 v4(11.5,36)
M2_DIR: length 46.7
  Top Layer w0.2: v4(30.88,21.87) 30.94,21.81 34.96,21.81 36.15,23 v4(36.36,23) ; v4(11.5,35) U1.42
  Bottom Layer w0.2: v4(11.5,35) 11.5,34.29 10.88,33.67 10.88,28.24 12.42,26.7 32.17,26.7 35.88,23 v4(36.36,23) ; DEC_TMC.8 28.13,20.32 29.3,21.49 30.49,21.49 v4(30.88,21.87)
M2_ENA: length 47.1
  Top Layer w0.2: 11,35.5 U1.44
  Bottom Layer w0.2: v4(11,35.5) 11,35.46 10.18,34.63 10.18,27.95 12.13,26 31.86,26 36.01,21.85 42.65,21.85 44.17,20.32 DEC_TMC.1
M2_ENCA: length 21.9
  Top Layer w0.2: U1.63 3.71,40.25 4.5,39.46 v4(4.5,35.75) ; R13.1 14.12,31.25 13.62,31.25 12.78,32.1 8.37,32.1 7.52,31.25 v4(6.88,31.25)
  Top Layer w0.5: R13.1 R10.2
  Bottom Layer w0.2: v4(4.5,35.75) 4.78,35.75 5.6,34.93 5.6,32.15 6.5,31.25 v4(6.88,31.25)
M2_ENCA_IN: length 40.7
  Top Layer w0.2: v4(23.5,22.87) 23.5,24.21 22.31,25.4 20.34,25.4 19.79,25.95 19.79,31.32 19.49,31.62 16.5,31.62 R10.1 ; v4(24.45,8.37) 25.26,8.37 25.65,7.97 25.65,3.77 25.25,3.38 23.75,3.38 23.38,3.74 H1.4
  Bottom Layer w0.2: v4(24.45,8.37) 25.17,8.37 25.75,8.95 25.75,20.24 23.5,22.49 v4(23.5,22.87)
M2_ENCB: length 21.7
  Top Layer w0.2: v4(6.88,30.25) 7.5,30.25 8.65,31.4 12.49,31.4 13.36,30.52 13.36,30.26 13.85,29.77 14.47,29.77 14.59,29.65 16.1,29.65 17,28.75 R14.1 R11.2 ; v4(4.5,34.75) 3.79,34.75 3.29,35.25 U1.43
  Bottom Layer w0.2: v4(4.5,34.75) 4.9,34.35 4.9,31.52 6.17,30.25 v4(6.88,30.25)
M2_ENCB_IN: length 33.5
  Top Layer w0.2: H1.6 22.11,3.8 22.94,2.97 25.67,2.97 26,3.31 26,8.37 25.51,8.87 v4(24.96,8.87) ; 18.25,27 20.2,25.05 22.16,25.05 23,24.21 v4(23,23.37)
  Bottom Layer w0.2: v4(23,23.37) 23,22.49 25.4,20.09 25.4,9.31 v4(24.96,8.87)
M2_M4: length 53.5
  Top Layer w0.2: v4(8.25,26.12) 8.12,26 v4(6.15,26) ; v4(3.97,31.37) 4.12,31.52 4.12,33.13 5.35,34.35 5.35,39.6 3.7,41.25 U1.67
  Bottom Layer w0.2: DEC_TMC.6 32,20.59 32,22.89 30.99,23.9 22.82,23.9 20.5,21.58 20.5,20.5 20,20 13.25,20 12.75,20.5 12.75,21.88 8.5,26.12 v4(8.25,26.12) ; v4(3.97,31.37) 3.97,31.16 5.53,29.61 5.53,26.62 v4(6.15,26)
M2_STEP: length 43.5
  Top Layer w0.2: DEC_TMC.7 30.71,20.32 31.85,21.46 35.11,21.46 35.99,22.35 v4(36.36,22.35) ; v4(11,34.5) U1.40
  Bottom Layer w0.2: v4(11,34.5) 10.53,34.03 10.53,28.1 12.28,26.35 32,26.35 36,22.35 v4(36.36,22.35)
MISO: length 53
  Top Layer w0.2: v4(3.5,39.75) 2.6,39.75 ; v4(13.31,24.98) 12.61,24.98 8.93,21.3 RA_TMC.5
  Bottom Layer w0.2: v4(3.5,39.75) 6.77,39.75 9.48,37.04 9.48,27.66 12.16,24.98 v4(13.31,24.98) 13.63,25.3 31.57,25.3 34.81,22.06 DEC_TMC.5
MOSI: length 63
  Top Layer w0.2: v4(4,39.25) 2.73,39.25 ; v4(12.85,24.48) 13.52,24.48 16.55,21.45 RA_TMC.2
  Bottom Layer w0.2: v4(4,39.25) 6.78,39.25 9.13,36.9 9.13,27.52 12.16,24.48 v4(12.85,24.48) 13.61,24.48 14.08,24.95 31.42,24.95 33.75,22.62 33.75,19.87 34.38,19.25 37.75,19.25 38.62,20.12 38.62,20.95 39.17,21.5 41.88,21.5 42.42,20.95 DEC_TMC.2
PPS: length 24.9
  Top Layer w0.2: 30.81,37.9 30.4,37.9 27.38,34.87 25,34.87 24.1,33.97 v4(23.69,33.97) ; v4(11.38,28.91) 11.29,29 U1.18
  Bottom Layer w0.2: v4(11.38,28.91) 11.66,28.91 13.76,31.02 16.66,31.02 19.75,34.1 23.57,34.1 v4(23.69,33.97)
PRG_ESP: length 28.3
  Top Layer w0.2: U1.60 10.62,39.5 10.89,39.77 v4(11.03,39.77)
  Bottom Layer w0.2: v4(11.03,39.77) 11.52,39.77 14.05,42.3 14.05,46.35 16.4,48.7 20.1,48.7 22.2,50.8 22.2,51.94 23.22,52.96 26.53,52.96 28.22,51.27 28.73,51.27
RST_ESP: length 32.4
  Top Layer w0.2: U1.58 10.75,39 10.87,39.12 v4(11.01,39.12)
  Bottom Layer w0.2: v4(11.01,39.12) 11.36,39.12 14.4,42.15 14.4,46.2 16.54,48.35 20.27,48.35 22.55,50.63 22.55,51.79 23.36,52.61 26.39,52.61 27.38,51.61 27.38,50.64 28.03,49.99 29.61,49.99 30.9,51.27 H2.4
RX_DEBUG: length 34.5
  Top Layer w0.2: U1.56 10.9,38.5 v4(11.03,38.37)
  Bottom Layer w0.2: H2.8 31.27,46.23 30,47.5 28.17,47.5 27.5,48.17 27.5,49.96 27.03,50.43 27.03,51.47 26.24,52.26 23.51,52.26 22.9,51.65 22.9,50.48 20.41,48 16.69,48 14.75,46.06 14.75,42.01 11.12,38.37 v4(11.03,38.37)
RX_GPS: length 29.4
  Top Layer w0.2: v4(11.38,29.56) 11.31,29.5 U1.20 ; v4(24.43,35.01) 24.23,35.21 23.69,35.21 22.84,34.36 22.84,33.62 23.34,33.12 24.25,33.12 25.3,34.17 27.66,34.17 29.06,35.57 30.81,35.57
  Bottom Layer w0.2: v4(11.38,29.56) 11.38,30.1 12.99,31.72 16.37,31.72 19.45,34.8 23.01,34.8 23.46,35.25 24.19,35.25 v4(24.43,35.01)
RX_REMOTE: length 14.7
  Top Layer w0.2: CN1.2 14.28,54.88 v4(15.84,54.88) ; R8.2 11.25,45.72 v4(11.25,46.5) 11.03,46.72 10.46,46.72
  Bottom Layer w0.2: v4(11.25,46.5) 10.9,46.85 10.9,47.49 11.41,48 12.46,48 14.2,49.74 14.2,53.23 v4(15.84,54.88)
SCK: length 57.1
  Top Layer w0.2: v4(13.23,23.94) 13.44,23.94 14.01,23.36 RA_TMC.3 ; v4(3.5,38.75) 2.47,38.75
  Bottom Layer w0.2: v4(3.5,38.75) 6.78,38.75 8.78,36.75 8.78,27.37 12.17,23.98 13.19,23.98 v4(13.23,23.94) 13.56,23.94 14.22,24.6 31.28,24.6 33.38,22.5 33.38,19.75 34.23,18.9 37.89,18.9 39.32,20.32 DEC_TMC.3
SCL: length 22.3
  Top Layer w0.2: U1.14 11.32,28 11.78,28.46 11.96,28.46 v4(12.38,28.87)
  Top Layer w0.25: v4(20,33.6) 19.75,33.85 19.75,35.75 19.01,36.49 17.08,36.49 16.63,36.04 16.63,35.49 15.81,34.66 14.75,34.66 14.32,34.23 R41.1
  Bottom Layer w0.2: v4(12.38,28.87) 12.38,29.13 13.91,30.67 16.81,30.67 19.74,33.6 v4(20,33.6)
SCLG: length 7.1
  Top Layer w0.2: U3.17 21.82,35.7 22.25,36.12 25.25,36.12 26.38,37.25 v1(27.62,37.25)
SDA: length 17.9
  Top Layer w0.2: U1.12 11.31,27.5 11.92,28.11 12.48,28.11 13.16,28.79 v4(13.16,29.19) ; v4(19.82,32.95) 18.9,33.87 R40.2
  Top Layer w0.25: R40.2 17.31,34.87 17.65,35.22 18.52,35.22
  Bottom Layer w0.2: v4(13.16,29.19) 13.16,29.43 14.05,30.32 16.95,30.32 19.58,32.95 v4(19.82,32.95)
SDAG: length 2.7
  Top Layer w0.2: v1(23.62,37.25) 23.17,36.8 U3.16
TX_DEBUG: length 30.7
  Top Layer w0.2: v4(11.33,40.78) 11.53,40.59 11.53,38.17 11.16,37.8 10.82,37.8 10.62,38 U1.54
  Bottom Layer w0.2: 28.73,53.81 28.73,53.51 28.53,53.31 23.07,53.31 21.85,52.08 21.85,50.94 19.96,49.05 16.25,49.05 13.7,46.49 13.7,42.45 12.03,40.78 v4(11.33,40.78)
TX_GPS: length 26.7
  Top Layer w0.2: U1.22 9.84,30.06 11.85,30.06 v4(11.95,29.97) ; 30.81,36.8 29.79,36.8 27.52,34.52 25.15,34.52 24.1,33.47 23.48,33.47 23.19,33.77 23.19,34.22 23.6,34.62 v4(23.88,34.62)
  Bottom Layer w0.2: v4(23.88,34.62) 23.33,34.62 23.16,34.45 19.6,34.45 16.52,31.37 13.14,31.37 11.95,30.18 v4(11.95,29.97)
TX_REMOTE: length 13.7
  Top Layer w0.2: CN1.3 13.7,52.4 v4(13.7,52.89) ; v4(12.25,48.5) 12.25,48.05 ; 12.5,44.54 12.21,44.54 v4(12,44.75) 11.79,44.54 11.5,44.54
  Bottom Layer w0.2: v4(12,44.75) 12,45.04 10.55,46.49 10.55,47.63 11.42,48.5 v4(12.25,48.5) 12.46,48.5 13.85,49.89 13.85,52.74 v4(13.7,52.89)
VUSB_IN: length 89.4
  Top Layer w0.2: U1.9 4.08,26.75 4.5,27.17 4.62,27.17 v4(4.67,27.21) 4.71,27.21 5.17,27.67 5.17,32.37 6.4,33.6 6.4,41.91 5.55,42.75 5.55,45.11 4.53,46.13 4.53,47 ; CN2.A9 4.5,49.97 4.75,50.22 4.75,50.74 ; CN2.A9 4.47,49.36 ; CN2.A9 4.5,47.03 4.53,47 ; v4(4.5,47) 4.53,47 ; 4.53,47 5.29,47 ; CN2.A4 7.5,49.96 7.25,50.21 CN2.B9 7.25,51.8 7.05,52 4.95,52 4.75,51.8 CN2.B4 ; v4(7.75,47) 7.07,47 D1.5
  Inner_1_GND w0.2: U13.3 29.88,2.88 28.96,2.88 28.96,2.88 28,2.88 28,2.88 26.37,2.88 25.5,2 19.5,2 18.88,2.62 18.88,4 17.25,5.62 9.75,5.62 7.75,7.62 7.75,14 2.62,19.12 2.62,26.37 3.5,27.25 4.63,27.25 v4(4.67,27.21)
  Bottom Layer w0.2: v4(7.75,47) v4(4.5,47)
$1N74185: length 22.8
  Top Layer w0.2: v4(10.5,44.75) 10.5,45.5 10.54,45.54 R8.1 ; v4(5.15,42.45) 5.15,41.74 5.7,41.19 5.7,33.89 4.47,32.66 4.47,30.09 3.63,29.25 U1.19
  Bottom Layer w0.2: v4(5.15,42.45) 8.2,42.45 v4(10.5,44.75)
$1N74186: length 22.7
  Top Layer w0.2: v4(10.58,44.08) 10.99,43.67 R7.1 ; v4(5.65,41.95) 6.05,41.55 6.05,33.74 4.82,32.52 4.82,29.95 3.63,28.75 U1.17
  Bottom Layer w0.2: v4(10.58,44.08) 10.33,44.08 8.35,42.1 5.8,42.1 v4(5.65,41.95)
$1N92540: length 2.7
  Top Layer w0.25: L1.1 19.38,40 20.37,39 U3.14
$1N104745: length 5.1
  Top Layer w0.2: CN2.B5 v4(5.25,51.5)
  Top Layer w0.5: v4(3.75,48.37) R5.2
  Bottom Layer w0.2: v4(5.25,51.5) 3.75,50 v4(3.75,48.37)
$1N104749: length 2.9
  Top Layer w0.2: CN2.A5 7,48.99 7.25,48.74 7.94,48.74 8.93,47.75 R9.1
$1N106279: length 1.2
  Top Layer w0.2: R35.2 12.01,54.45 LED2.2
$1N106286: length 1.7
  Top Layer w0.2: LED1.2 R12.1
$1N143386: length 11.9
  Top Layer w0.25: L1.2 19.72,42.3 U3.11
  Top Layer w1: JP1.1 24.8,49.23 24.8,43.3 23.8,42.3 21.19,42.3
$1N173382: length 13.6
  Top Layer w0.25: 17.38,43.32 17.38,40.8 C84.1 18.22,39.6 18.22,39.03 ; R41.2 16.44,33.87 16.4,33.91 16.4,34.65 17.21,35.45 v4(17.21,35.8) ; v4(16.44,38.5) 16.97,39.03 18.22,39.03 ; 18.22,39.03 18.52,39.03
  Bottom Layer w0.25: v4(17.21,35.8) 17.21,37.74 v4(16.44,38.5)
$3N2384: length 1.6
  Top Layer w0.2: D3.1 14.38,42.04 R17.1
$3N2780: length 4.4
  Top Layer w0.5: 45.35,39.75 46.52,39.75 C13.2 48.22,38.05 L2.1
$3N23825: length 1.3
  Top Layer w0.5: C13.1 46.47,40.7 45.35,40.7
$3N39858: length 17.3
  Top Layer w0.2: PS1.5 49.06,48.02 38.97,48.02 38.19,47.25 36.94,47.25 36.01,46.32 v4(36.01,44.75)
  Top Layer w0.25: U8.4 36.18,44.32 36.01,44.49 v4(36.01,44.75) R18.2
$3N39869: length 23.6
  Top Layer w0.35: U8.3 36.73,44.7 38.15,46.12 ; 38.62,46.12 38.75,46 38.75,45.82 ; 37.47,43.9 37.47,44.11 38.85,45.49 38.85,45.03 U8.1 ; 38.21,45.28 38.4,45.47 38.6,45.78 DC1.1 ; 38.21,45.28 37.78,45.28 36.97,44.47 36.97,43.9 ; 38.21,45.28 37.22,44.3 U8.1
  Top Layer w0.5: IN1.2 46.6,46.62 48.3,46.62 PS1.4
  Top Layer w1.8: IN1.2 39.52,46.77 38.75,46 DC1.1
$3N39927: length 2.5
  Top Layer w0.5: 46.71,55.83 PS1.1
$3N39977: length 1.2
  Top Layer w0.3: U8.7 33.84,43 C30.2
$3N40219: length 1.9
  Top Layer w0.25: U8.14 36.18,39.18 R32.2
$3N40264: length 2.6
  Top Layer w0.3: C33.1 33,39.45 33.3,39.75 34.82,39.75 U8.12
$3N40420: length 2.2
  Top Layer w0.25: U8.13 35.67,39.67 35.25,39.25 34.42,39.25 R31.2
$3N44061: length 3.9
  Top Layer w0.5: L3.1 48.75,36.45 C37.2 46.45,36.5 45.2,36.5
$3N44065: length 1.3
  Top Layer w0.5: 45.2,37.45 46.41,37.45 C37.1

## Copper pours and planes (outline as drawn; the poured copper is in the pictures)
+3.3V on Top Layer: 50.5,35.25 50.5,32.75 46.75,32.75 46.75,34.75 47.25,34.75 47.25,35.25
+5V on Top Layer: 47.3,41.95 50.5,41.95 50.5,39.5 47.3,39.5
GND on Top Layer: 0,55 0.02,55.28 0.08,55.56 0.18,55.83 0.32,56.08 0.49,56.31 0.69,56.51 0.92,56.68 1.17,56.82 1.44,56.92 1.72,56.98 2,57 50,57 50.28,56.98 50.56,56.92 50.83,56.82 51.08,56.68 51.31,56.51 51.51,56.31 51.68,56.08 51.82,55.83 51.92,55.56 51.98,55.28 52,55 52,1 51.98,0.72 51.92,0.44 51.82,0.17 51.68,-0.08 51.51,-0.31 51.31,-0.51 51.08,-0.68 50.83,-0.82 50.56,-0.92 50.28,-0.98 50,-1 2,-1 1.72,-0.98 1.44,-0.92 1.17,-0.82 0.92,-0.68 0.69,-0.51 0.49,-0.31 0.32,-0.08 0.18,0.17 0.08,0.44 0.02,0.72 0,1
GND on Bottom Layer: 0,55 0.02,55.28 0.08,55.56 0.18,55.83 0.32,56.08 0.49,56.31 0.69,56.51 0.92,56.68 1.17,56.82 1.44,56.92 1.72,56.98 2,57 50,57 50.28,56.98 50.56,56.92 50.83,56.82 51.08,56.68 51.31,56.51 51.51,56.31 51.68,56.08 51.82,55.83 51.92,55.56 51.98,55.28 52,55 52,1 51.98,0.72 51.92,0.44 51.82,0.17 51.68,-0.08 51.51,-0.31 51.31,-0.51 51.08,-0.68 50.83,-0.82 50.56,-0.92 50.28,-0.98 50,-1 2,-1 1.72,-0.98 1.44,-0.92 1.17,-0.82 0.92,-0.68 0.69,-0.51 0.49,-0.31 0.32,-0.08 0.18,0.17 0.08,0.44 0.02,0.72 0,1
GND on Inner_1_GND: 0,55 0.02,55.28 0.08,55.56 0.18,55.83 0.32,56.08 0.49,56.31 0.69,56.51 0.92,56.68 1.17,56.82 1.44,56.92 1.72,56.98 2,57 50,57 50.28,56.98 50.56,56.92 50.83,56.82 51.08,56.68 51.31,56.51 51.51,56.31 51.68,56.08 51.82,55.83 51.92,55.56 51.98,55.28 52,55 52,1 51.98,0.72 51.92,0.44 51.82,0.17 51.68,-0.08 51.51,-0.31 51.31,-0.51 51.08,-0.68 50.83,-0.82 50.56,-0.92 50.28,-0.98 50,-1 2,-1 1.72,-0.98 1.44,-0.92 1.17,-0.82 0.92,-0.68 0.69,-0.51 0.49,-0.31 0.32,-0.08 0.18,0.17 0.08,0.44 0.02,0.72 0,1
GND on Inner_2_GND: 0,55 0.02,55.28 0.08,55.56 0.18,55.83 0.32,56.08 0.49,56.31 0.69,56.51 0.92,56.68 1.17,56.82 1.44,56.92 1.72,56.98 2,57 50,57 50.28,56.98 50.56,56.92 50.83,56.82 51.08,56.68 51.31,56.51 51.51,56.31 51.68,56.08 51.82,55.83 51.92,55.56 51.98,55.28 52,55 52,1 51.98,0.72 51.92,0.44 51.82,0.17 51.68,-0.08 51.51,-0.31 51.31,-0.51 51.08,-0.68 50.83,-0.82 50.56,-0.92 50.28,-0.98 50,-1 2,-1 1.72,-0.98 1.44,-0.92 1.17,-0.82 0.92,-0.68 0.69,-0.51 0.49,-0.31 0.32,-0.08 0.18,0.17 0.08,0.44 0.02,0.72 0,1

## Text on the board
Bottom Silkscreen Layer: /EN | VIN | 3.3V | GND | GitHub/HEMY-02/25 | JLCJLCJLCJLC | G | K | R | B | Rechargeable / only | 5V | A | - + | 1B | 1A | RA / AZ | 2A | 2B | DEC / ALT | BRAKE | groups.io/g/teenastro | Enc AZ / Enc ALT | +  - | Project Wiki | v2.6.5M | SHC | USB | 12V 3A | TeenAstro / Redux | by zUrp | 3.3V -> | -TEENSY- | -DEBUG- | -GPS- | SDA.GPS | SCL.GPS
Top Silkscreen Layer: - + | RA | DEC
